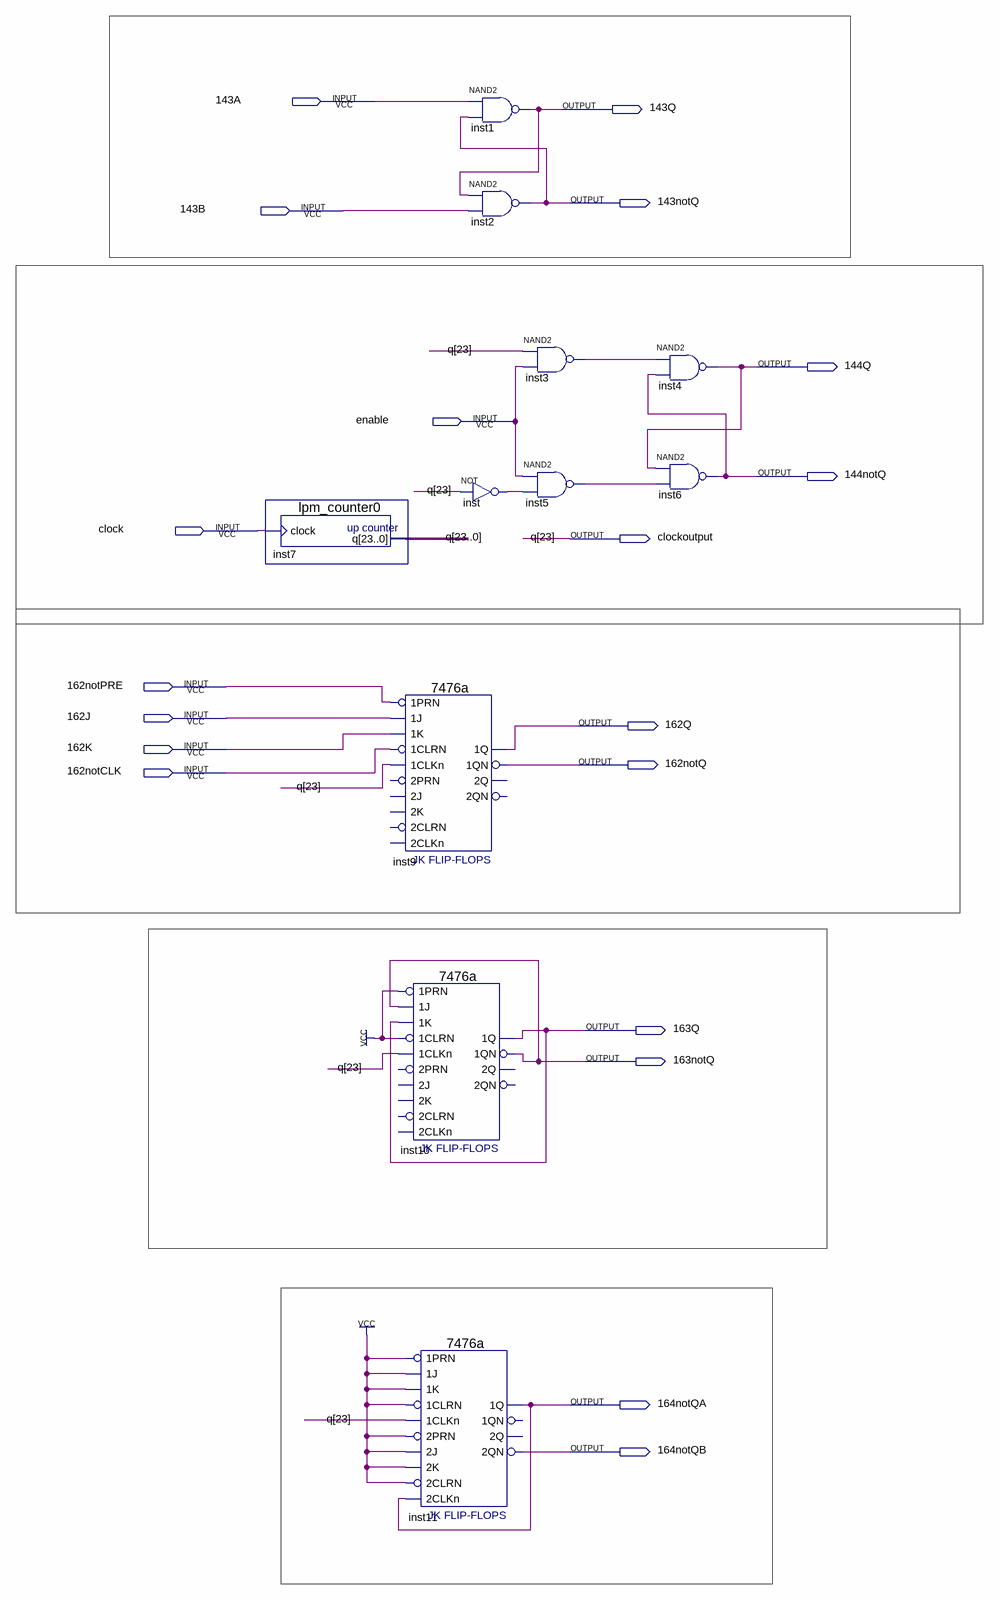
[diagram p0: schematic sheet]
// Quartus schematic Test4.bdf as structural Verilog: 11 symbols, 19 pins
module Test4 (
  input  \143A ,
  input  \143B ,
  input  enable,
  input  clock,
  input  \162notPRE ,
  input  \162J ,
  input  \162K ,
  input  \162notCLK ,
  output \143Q ,
  output \143notQ ,
  output \144Q ,
  output \144notQ ,
  output clockoutput,
  output \162Q ,
  output \162notQ ,
  output \163Q ,
  output \163notQ ,
  output \164notQA ,
  output \164notQB 
);

  wire inst3_out, inst5_out, inst_out;
  wire [22:0] q;

  lpm_counter0 inst7 (.clock(clock), .q({clockoutput, q}));
  \7476a  inst9 (
    .\1PRN (\162notPRE ), .\1K (\162K ), .\1J (\162J ), .\1CLRN (\162notCLK ), .\1CLKn (clockoutput),
    .\1QN (\162notQ ), .\1Q (\162Q ));  // open: 2CLKn, 2CLRN, 2K, 2J, 2PRN, 2QN, 2Q
  \7476a  inst10 (
    .\1PRN (1'b1), .\1K (\163Q ), .\1J (\163notQ ), .\1CLRN (1'b1), .\1CLKn (clockoutput), .\1QN (\163notQ ),
    .\1Q (\163Q ));  // open: 2CLKn, 2CLRN, 2K, 2J, 2PRN, 2QN, 2Q
  \7476a  inst11 (
    .\2CLKn (\164notQA ), .\2CLRN (1'b1), .\1PRN (1'b1), .\1K (1'b1), .\1J (1'b1), .\1CLRN (1'b1),
    .\1CLKn (clockoutput), .\2K (1'b1), .\2J (1'b1), .\2PRN (1'b1), .\2QN (\164notQB ), .\1Q (\164notQA ));  // open: 2Q, 1QN
  nand inst1 (\143Q , \143A , \143notQ );
  nand inst2 (\143notQ , \143Q , \143B );
  not inst (inst_out, clockoutput);
  nand inst3 (inst3_out, clockoutput, enable);
  nand inst5 (inst5_out, enable, inst_out);
  nand inst4 (\144Q , inst3_out, \144notQ );
  nand inst6 (\144notQ , \144Q , inst5_out);

  // Other names for the same wires on the sheet: q[23] = clockoutput
endmodule
